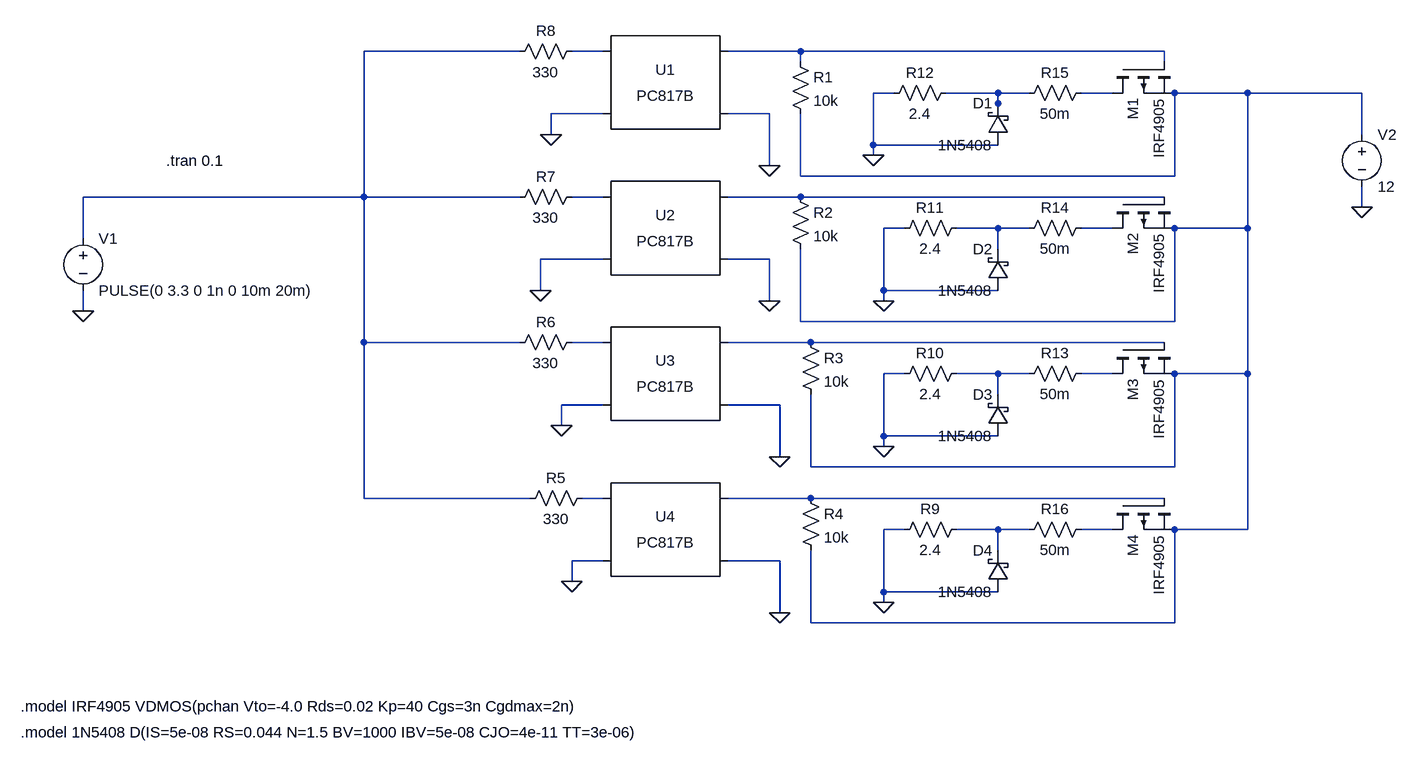
[diagram p0: schematic International_v1.asc]
International_v1.asc, the LTspice schematic file:
Version 4
SHEET 1 1528 968
WIRE 176 -96 -64 -96
WIRE 304 -96 256 -96
WIRE 608 -96 496 -96
WIRE 1168 -96 608 -96
WIRE 608 -80 608 -96
WIRE 1168 -80 1168 -96
WIRE 752 -32 720 -32
WIRE 912 -32 832 -32
WIRE 960 -32 912 -32
WIRE 1088 -32 1040 -32
WIRE 1296 -32 1184 -32
WIRE 1472 -32 1296 -32
WIRE 912 -16 912 -32
WIRE 304 0 224 0
WIRE 560 0 496 0
WIRE 912 0 912 -16
WIRE 224 32 224 0
WIRE 1472 32 1472 -32
WIRE 720 48 720 -32
WIRE 912 48 720 48
WIRE 720 64 720 48
WIRE 560 80 560 0
WIRE 608 96 608 0
WIRE 1184 96 1184 -32
WIRE 1184 96 608 96
WIRE -64 128 -64 -96
WIRE -64 128 -496 128
WIRE 176 128 -64 128
WIRE 304 128 256 128
WIRE 608 128 496 128
WIRE 1168 128 608 128
WIRE 1472 144 1472 112
WIRE 768 176 736 176
WIRE 912 176 848 176
WIRE 960 176 912 176
WIRE 1088 176 1040 176
WIRE 1296 176 1296 -32
WIRE 1296 176 1184 176
WIRE -496 192 -496 128
WIRE 912 208 912 176
WIRE 304 224 208 224
WIRE 560 224 496 224
WIRE 208 272 208 224
WIRE 736 272 736 176
WIRE 912 272 736 272
WIRE 560 288 560 224
WIRE 736 288 736 272
WIRE -496 304 -496 272
WIRE 608 320 608 208
WIRE 1184 320 1184 176
WIRE 1184 320 608 320
WIRE -64 352 -64 128
WIRE 176 352 -64 352
WIRE 304 352 256 352
WIRE 624 352 496 352
WIRE 1168 352 624 352
WIRE 768 400 736 400
WIRE 912 400 848 400
WIRE 960 400 912 400
WIRE 1088 400 1040 400
WIRE 1296 400 1296 176
WIRE 1296 400 1184 400
WIRE 912 432 912 400
WIRE 304 448 240 448
WIRE 576 448 496 448
WIRE 240 480 240 448
WIRE 736 496 736 400
WIRE 912 496 736 496
WIRE 736 512 736 496
WIRE 576 528 576 448
WIRE 624 544 624 432
WIRE 1184 544 1184 400
WIRE 1184 544 624 544
WIRE -64 592 -64 352
WIRE 192 592 -64 592
WIRE 304 592 272 592
WIRE 624 592 496 592
WIRE 1168 592 624 592
WIRE 768 640 736 640
WIRE 912 640 848 640
WIRE 960 640 912 640
WIRE 1088 640 1040 640
WIRE 1296 640 1296 400
WIRE 1296 640 1184 640
WIRE 912 672 912 640
WIRE 304 688 256 688
WIRE 576 688 496 688
WIRE 256 720 256 688
WIRE 736 736 736 640
WIRE 912 736 736 736
WIRE 736 752 736 736
WIRE 576 768 576 688
WIRE 624 784 624 672
WIRE 1184 784 1184 640
WIRE 1184 784 624 784
FLAG 224 32 0
FLAG 208 272 0
FLAG 240 480 0
FLAG 256 720 0
FLAG 1472 144 0
FLAG -496 304 0
FLAG 736 512 0
FLAG 736 288 0
FLAG 720 64 0
FLAG 736 752 0
FLAG 560 80 0
FLAG 560 288 0
FLAG 576 528 0
FLAG 576 768 0
SYMBOL voltage -496 176 R0
WINDOW 123 0 0 Left 0
WINDOW 39 0 0 Left 0
SYMATTR InstName V1
SYMATTR Value PULSE(0 3.3 0 1n 0 10m 20m)
SYMBOL voltage 1472 16 R0
WINDOW 123 0 0 Left 0
WINDOW 39 0 0 Left 0
SYMATTR InstName V2
SYMATTR Value 12
SYMBOL res 592 -96 R0
SYMATTR InstName R1
SYMATTR Value 10k
SYMBOL res 592 112 R0
SYMATTR InstName R2
SYMATTR Value 10k
SYMBOL res 608 336 R0
SYMATTR InstName R3
SYMATTR Value 10k
SYMBOL res 608 576 R0
SYMATTR InstName R4
SYMATTR Value 10k
SYMBOL res 288 576 R90
WINDOW 0 0 56 VBottom 2
WINDOW 3 32 56 VTop 2
SYMATTR InstName R5
SYMATTR Value 330
SYMBOL res 272 336 R90
WINDOW 0 0 56 VBottom 2
WINDOW 3 32 56 VTop 2
SYMATTR InstName R6
SYMATTR Value 330
SYMBOL res 272 112 R90
WINDOW 0 0 56 VBottom 2
WINDOW 3 32 56 VTop 2
SYMATTR InstName R7
SYMATTR Value 330
SYMBOL res 272 -112 R90
WINDOW 0 0 56 VBottom 2
WINDOW 3 32 56 VTop 2
SYMATTR InstName R8
SYMATTR Value 330
SYMBOL res 864 624 R90
WINDOW 0 0 56 VBottom 2
WINDOW 3 32 56 VTop 2
SYMATTR InstName R9
SYMATTR Value 2.4
SYMBOL res 864 384 R90
WINDOW 0 0 56 VBottom 2
WINDOW 3 32 56 VTop 2
SYMATTR InstName R10
SYMATTR Value 2.4
SYMBOL res 864 160 R90
WINDOW 0 0 56 VBottom 2
WINDOW 3 32 56 VTop 2
SYMATTR InstName R11
SYMATTR Value 2.4
SYMBOL res 848 -48 R90
WINDOW 0 0 56 VBottom 2
WINDOW 3 32 56 VTop 2
SYMATTR InstName R12
SYMATTR Value 2.4
SYMBOL pmos 1088 -80 M90
SYMATTR InstName M1
SYMATTR Value IRF4905
SYMBOL pmos 1088 128 M90
SYMATTR InstName M2
SYMATTR Value IRF4905
SYMBOL pmos 1088 352 M90
SYMATTR InstName M3
SYMATTR Value IRF4905
SYMBOL pmos 1088 592 M90
SYMATTR InstName M4
SYMATTR Value IRF4905
SYMBOL Optos\\PC817B 400 -48 R0
SYMATTR InstName U1
SYMBOL Optos\\PC817B 400 176 R0
SYMATTR InstName U2
SYMBOL Optos\\PC817B 400 400 R0
SYMATTR InstName U3
SYMBOL Optos\\PC817B 400 640 R0
SYMATTR InstName U4
SYMBOL res 1056 384 R90
WINDOW 0 0 56 VBottom 2
WINDOW 3 32 56 VTop 2
SYMATTR InstName R13
SYMATTR Value 50m
SYMBOL res 1056 160 R90
WINDOW 0 0 56 VBottom 2
WINDOW 3 32 56 VTop 2
SYMATTR InstName R14
SYMATTR Value 50m
SYMBOL res 1056 -48 R90
WINDOW 0 0 56 VBottom 2
WINDOW 3 32 56 VTop 2
SYMATTR InstName R15
SYMATTR Value 50m
SYMBOL res 1056 624 R90
WINDOW 0 0 56 VBottom 2
WINDOW 3 32 56 VTop 2
SYMATTR InstName R16
SYMATTR Value 50m
SYMBOL schottky 928 48 R180
WINDOW 0 24 64 Left 2
WINDOW 3 24 0 Left 2
SYMATTR InstName D1
SYMATTR Value 1N5408
SYMATTR Description Diode
SYMATTR Type diode
SYMBOL schottky 928 272 R180
WINDOW 0 24 64 Left 2
WINDOW 3 24 0 Left 2
SYMATTR InstName D2
SYMATTR Value 1N5408
SYMATTR Description Diode
SYMATTR Type diode
SYMBOL schottky 928 496 R180
WINDOW 0 24 64 Left 2
WINDOW 3 24 0 Left 2
SYMATTR InstName D3
SYMATTR Value 1N5408
SYMATTR Description Diode
SYMATTR Type diode
SYMBOL schottky 928 736 R180
WINDOW 0 24 64 Left 2
WINDOW 3 24 0 Left 2
SYMATTR InstName D4
SYMATTR Value 1N5408
SYMATTR Description Diode
SYMATTR Type diode
TEXT -368 72 Left 2 !.tran 0.1
TEXT -592 912 Left 2 !.model IRF4905 VDMOS(pchan Vto=-4.0 Rds=0.02 Kp=40 Cgs=3n Cgdmax=2n)
TEXT -592 952 Left 2 !.model 1N5408 D(IS=5e-08 RS=0.044 N=1.5 BV=1000 IBV=5e-08 CJO=4e-11 TT=3e-06)

The netlist it stands for:
* International_v1.asc
V1 N001 0 PULSE(0 3.3 0 1n 0 10m 20m)
V2 N006 0 12
R1 N003 N006 10k
R2 N008 N006 10k
R3 N012 N006 10k
R4 N016 N006 10k
R5 N015 N001 330
R6 N011 N001 330
R7 N007 N001 330
R8 N002 N001 330
R9 N017 0 2.4
R10 N013 0 2.4
R11 N009 0 2.4
R12 N004 0 2.4
M1 N005 N003 N006 N006 IRF4905
M2 N010 N008 N006 N006 IRF4905
M3 N014 N012 N006 N006 IRF4905
M4 N018 N016 N006 N006 IRF4905
XU1 N002 0 N003 0 PC817 Igain=1.5m
XU2 N007 0 N008 0 PC817 Igain=1.5m
XU3 N011 0 N012 0 PC817 Igain=1.5m
XU4 N015 0 N016 0 PC817 Igain=1.5m
R13 N014 N013 50m
R14 N010 N009 50m
R15 N005 N004 50m
R16 N018 N017 50m
D1 0 N004 1N5408
D2 0 N009 1N5408
D3 0 N013 1N5408
D4 0 N017 1N5408
.model D D
.lib standard.dio
.model NMOS NMOS
.model PMOS PMOS
.lib standard.mos
.tran 0.1
.model IRF4905 VDMOS(pchan Vto=-4.0 Rds=0.02 Kp=40 Cgs=3n Cgdmax=2n)
.model 1N5408 D(IS=5e-08 RS=0.044 N=1.5 BV=1000 IBV=5e-08 CJO=4e-11 TT=3e-06)
.lib PC817.sub
.backanno
.end